# EAGLE schematic main (EAGLE 9.6.2)
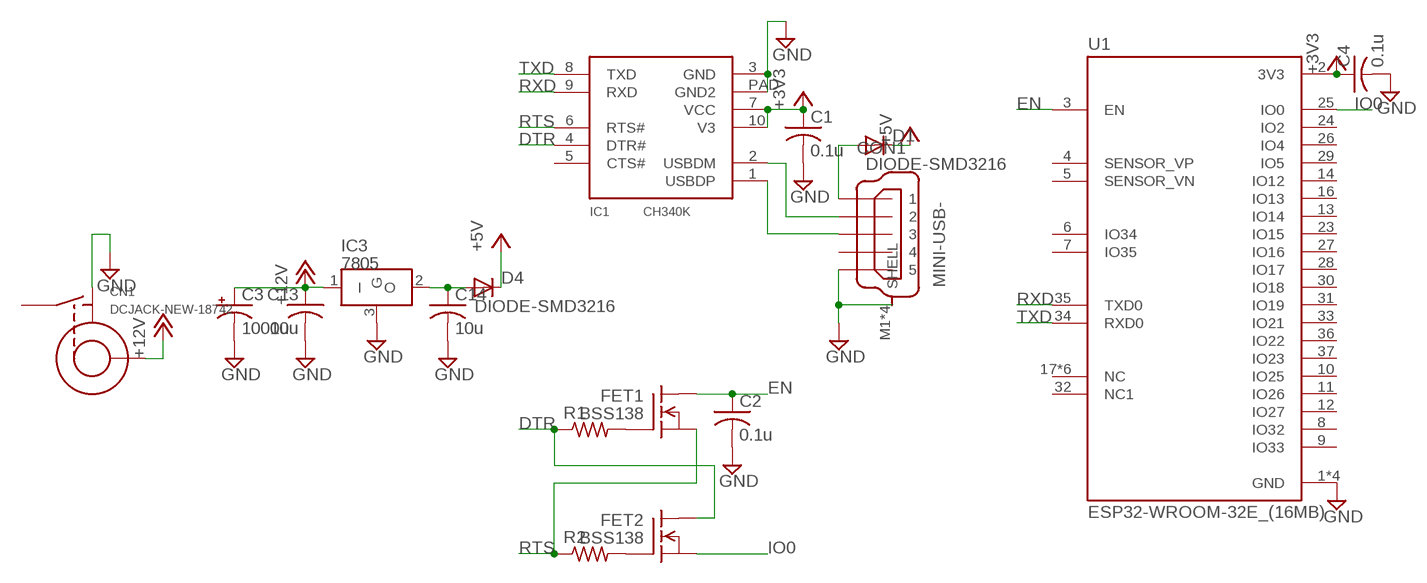
[diagram p0: schematic, sheet 1]

## Parts
C1  0.1u  C-2012  [2012-C]
C2  0.1u  C-2012  [2012-C]
C3  1000u  CC-2.5-8  [E2,5-8]
C4  0.1u  C-2012  [2012-C]
C13  10u  C-3216  [3216]
C14  10u  C-3216  [3216]
CN1  DCJACK-NEW-18742  [18742]
CON1  MINI-USB-  [UX60A-MB-5ST]
D1  DIODE-SMD3216  [D3216]
D4  DIODE-SMD3216  [D3216]
FET1  BSS138  [SOT23]
FET2  BSS138  [SOT23]
IC1  CH340K  [HSSOP10]
IC3  7805  [P-HSIP3_2.30A]
R1  R-2012  [2012-R]
R2  R-2012  [2012-R]
U1  ESP32-WROOM-32E_(16MB)  [XCVR_ESP32-WROOM-32E_(16MB)]

## Nets
+3V3: C1.1 C4.1 IC1.7(VCC) IC1.10(V3) U1.2(3V3)
+5V: D1.K(C) D4.K(C)
+12V: C3.+ C13.1 CN1.P$1(CENTER) IC3.1(I)
DTR: FET2.3(D) IC1.4(DTR#) R1.1
EN: C2.1 FET1.3(D) U1.3(EN)
GND: C1.2 C2.2 C3.- C4.2 C13.2 C14.2 CN1.P$2(TIP) CON1.5 CON1.M1(SHELL) CON1.M2(SHELL) CON1.M3(SHELL) CON1.M4(SHELL) IC1.3(GND) IC1.PAD(GND2) IC3.3(G) U1.1(GND) U1.15(GND) U1.38(GND) U1.P$1(GND)
IO0: FET2.2(S) U1.25(IO0)
N$1: CON1.3 IC1.1(USBDP)
N$2: CON1.2 IC1.2(USBDM)
N$3: FET1.1(G) R1.2
N$4: FET2.1(G) R2.2
N$5: CON1.1 D1.A
O: C14.1 D4.A IC3.2(O)
RTS: FET1.2(S) IC1.6(RTS#) R2.1
RXD: IC1.9(RXD) U1.35(TXD0)
TXD: IC1.8(TXD) U1.34(RXD0)
Unconnected: CN1.P$3(SHUNT) CON1.4 IC1.5(CTS#) U1.4(SENSOR_VP) U1.5(SENSOR_VN) U1.6(IO34) U1.7(IO35) U1.8(IO32) U1.9(IO33) U1.10(IO25) U1.11(IO26) U1.12(IO27) U1.13(IO14) U1.14(IO12) U1.16(IO13) U1.17(NC) U1.18(NC) U1.19(NC) U1.20(NC) U1.21(NC) U1.22(NC) U1.23(IO15) U1.24(IO2) U1.26(IO4) U1.27(IO16) U1.28(IO17) U1.29(IO5) U1.30(IO18) U1.31(IO19) U1.32(NC1) U1.33(IO21) U1.36(IO22) U1.37(IO23)

## Library data of the parts
C1 C13 C14 = Passive_Robotech:C
C2 C4 = Passive_Robotech:C; SPICEPREFIX: C
C3 = Passive_Robotech:CC
CN1 = Connector_Robotech:DCJACK-NEW
CON1 = Connector_Robotech:MINI-USB-: MINI USB Connector Source: http://www.hirose.co.jp/cataloge_hp/e24000019.pdf
D1 D4 = Diode_Robotech:DIODE
FET1 FET2 = Transistor_Robotech:BSS138: 50V N-Channel Enhancement Mode MOSFET - ESD Protected; SPICEPREFIX: J
IC1 = IC_Robotech:CH340K
IC3 = IC_Robotech:78*: Three Terminal Voltage Regulator
R1 R2 = Passive_Robotech:R; SPICEPREFIX: R
U1 = ESP32-WROOM-32E__16MB_:ESP32-WROOM-32E_(16MB): Check availability <https://pricing.snapeda.com/parts/ESP32-WROOM-32E%20%2816MB%29/Espressif%20Systems/view-part?ref=eda>; AVAILABILITY: Not in stock; DESCRIPTION: Bluetooth, WiFi 802.11b/g/n, Bluetooth v4.2 +EDR, Class 1, 2 and 3 Transceiver Module 2.4GHz ~ 2.5GHz Integrated, Trace Surface Mount; MF: Espressif Systems; MP: ESP32-WROOM-32E (16MB); PACKAGE: None; PRICE: None